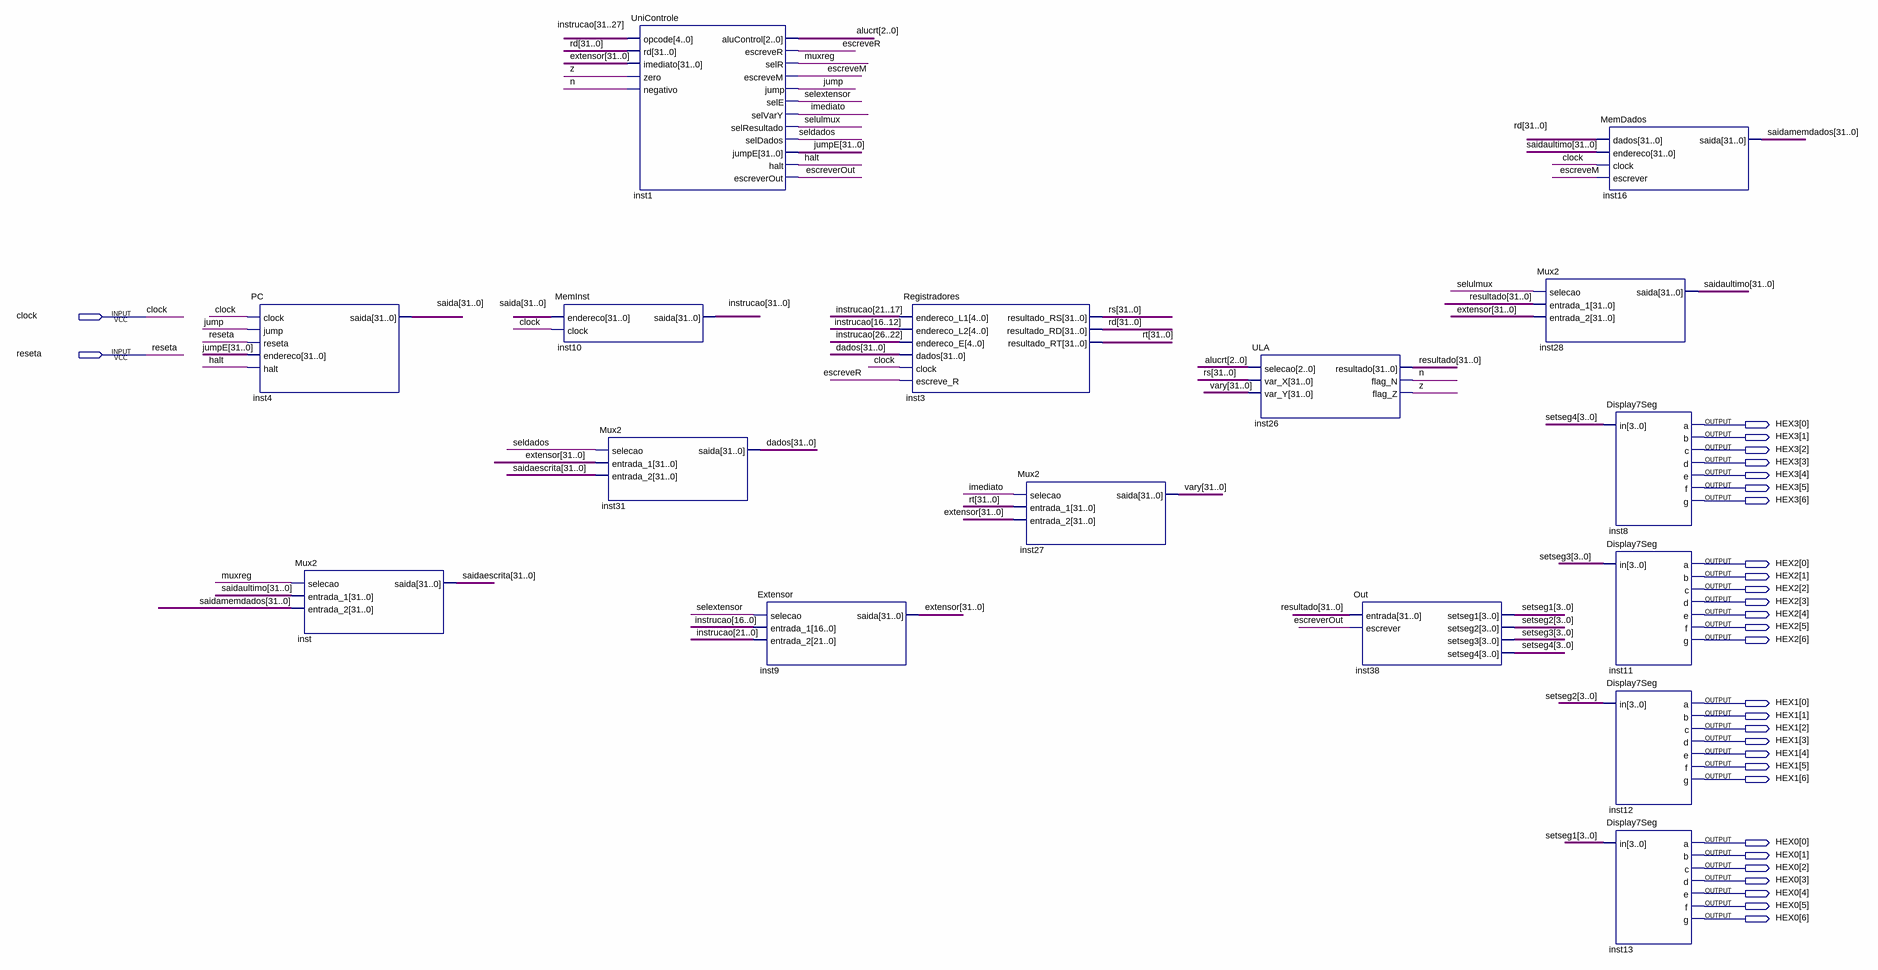
[diagram p0: schematic sheet]
// Quartus schematic verilog.bdf as structural Verilog: 16 symbols, 30 pins
module verilog (
  input  clock,
  input  reseta,
  output [6:0] HEX3,
  output [6:0] HEX2,
  output [6:0] HEX1,
  output [6:0] HEX0
);

  wire escreveM, escreveR, escreverOut, halt, imediato, jump, muxreg, n, seldados, selextensor, selulmux, z;
  wire [2:0] alucrt;
  wire [3:0] setseg1, setseg2, setseg3, setseg4;
  wire [31:0] dados, extensor, instrucao, jumpE, rd, resultado, rs, rt, saida, saidaescrita, saidamemdados,
       saidaultimo, vary;

  PC inst4 (.clock(clock), .jump(jump), .reseta(reseta), .endereco(jumpE), .halt(halt), .saida(saida));
  Mux2 inst (.selecao(muxreg), .entrada_1(saidaultimo), .entrada_2(saidamemdados), .saida(saidaescrita));
  MemInst inst10 (.endereco(saida), .clock(clock), .saida(instrucao));
  Mux2 inst31 (.selecao(seldados), .entrada_1(extensor), .entrada_2(saidaescrita), .saida(dados));
  UniControle inst1 (
    .opcode(instrucao[31:27]), .rd(rd), .imediato(extensor), .zero(z), .negativo(n), .aluControl(alucrt),
    .escreveR(escreveR), .selR(muxreg), .escreveM(escreveM), .jump(jump), .selE(selextensor),
    .selVarY(imediato), .selResultado(selulmux), .selDados(seldados), .jumpE(jumpE), .halt(halt),
    .escreverOut(escreverOut));
  Extensor inst9 (.selecao(selextensor), .entrada_1(instrucao[16:0]), .entrada_2(instrucao[21:0]), .saida(extensor));
  Registradores inst3 (
    .endereco_L1(instrucao[21:17]), .endereco_L2(instrucao[16:12]), .endereco_E(instrucao[26:22]),
    .dados(dados), .clock(clock), .escreve_R(escreveR), .resultado_RS(rs), .resultado_RD(rd),
    .resultado_RT(rt));
  Mux2 inst27 (.selecao(imediato), .entrada_1(rt), .entrada_2(extensor), .saida(vary));
  ULA inst26 (.selecao(alucrt), .var_X(rs), .var_Y(vary), .resultado(resultado), .flag_N(n), .flag_Z(z));
  Out inst38 (
    .entrada(resultado), .escrever(escreverOut), .setseg1(setseg1), .setseg2(setseg2), .setseg3(setseg3),
    .setseg4(setseg4));
  Mux2 inst28 (.selecao(selulmux), .entrada_1(resultado), .entrada_2(extensor), .saida(saidaultimo));
  MemDados inst16 (.dados(rd), .endereco(saidaultimo), .clock(clock), .escrever(escreveM), .saida(saidamemdados));
  Display7Seg inst8 (
    .in(setseg4), .a(HEX3[0]), .b(HEX3[1]), .c(HEX3[2]), .d(HEX3[3]), .e(HEX3[4]), .f(HEX3[5]), .g(HEX3[6]));
  Display7Seg inst11 (
    .in(setseg3), .a(HEX2[0]), .b(HEX2[1]), .c(HEX2[2]), .d(HEX2[3]), .e(HEX2[4]), .f(HEX2[5]), .g(HEX2[6]));
  Display7Seg inst12 (
    .in(setseg2), .a(HEX1[0]), .b(HEX1[1]), .c(HEX1[2]), .d(HEX1[3]), .e(HEX1[4]), .f(HEX1[5]), .g(HEX1[6]));
  Display7Seg inst13 (
    .in(setseg1), .a(HEX0[0]), .b(HEX0[1]), .c(HEX0[2]), .d(HEX0[3]), .e(HEX0[4]), .f(HEX0[5]), .g(HEX0[6]));
endmodule
